# EasyEDA Pro project 测试用途.eprj, board PCB14
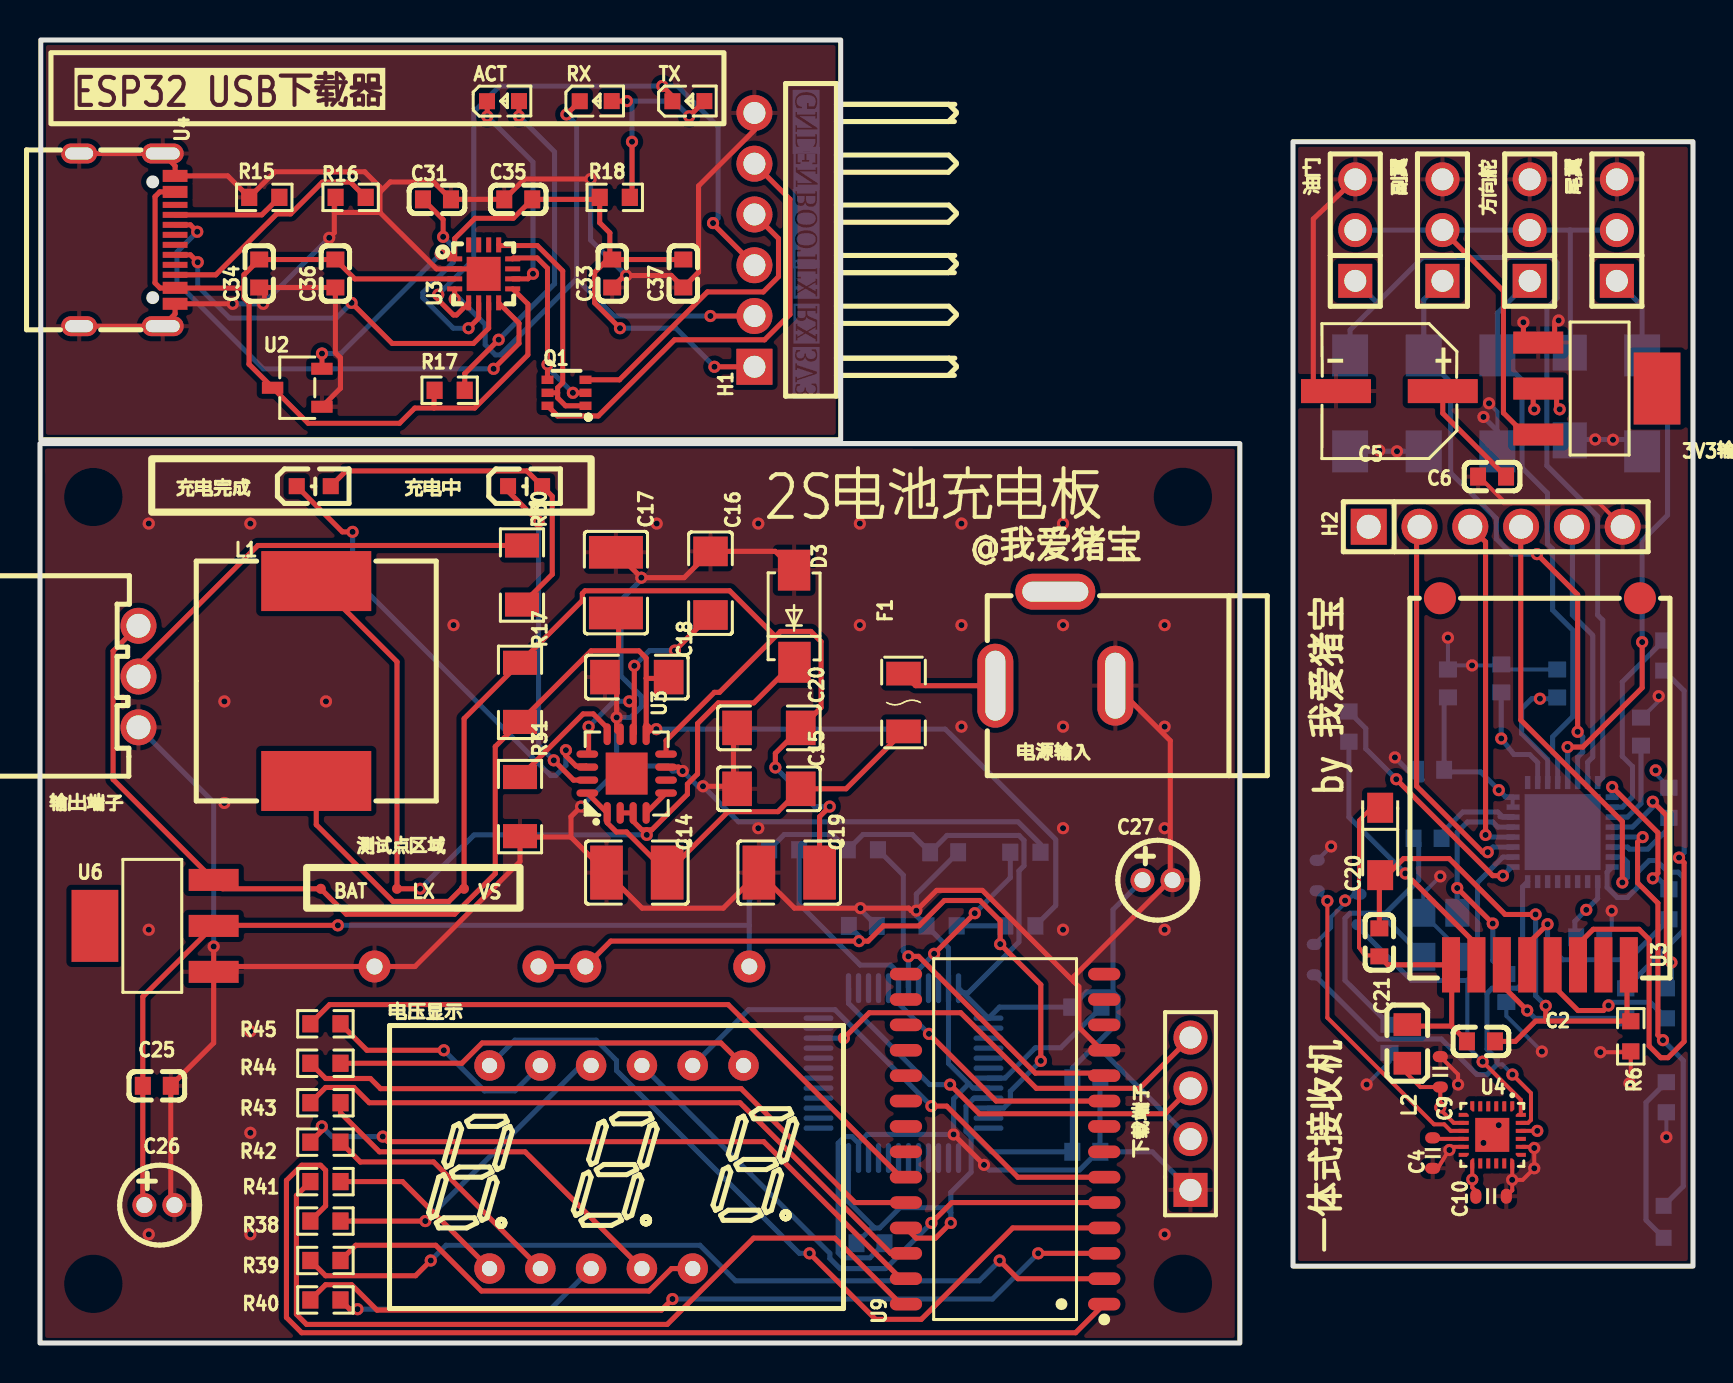
[diagram p13: board, top side]
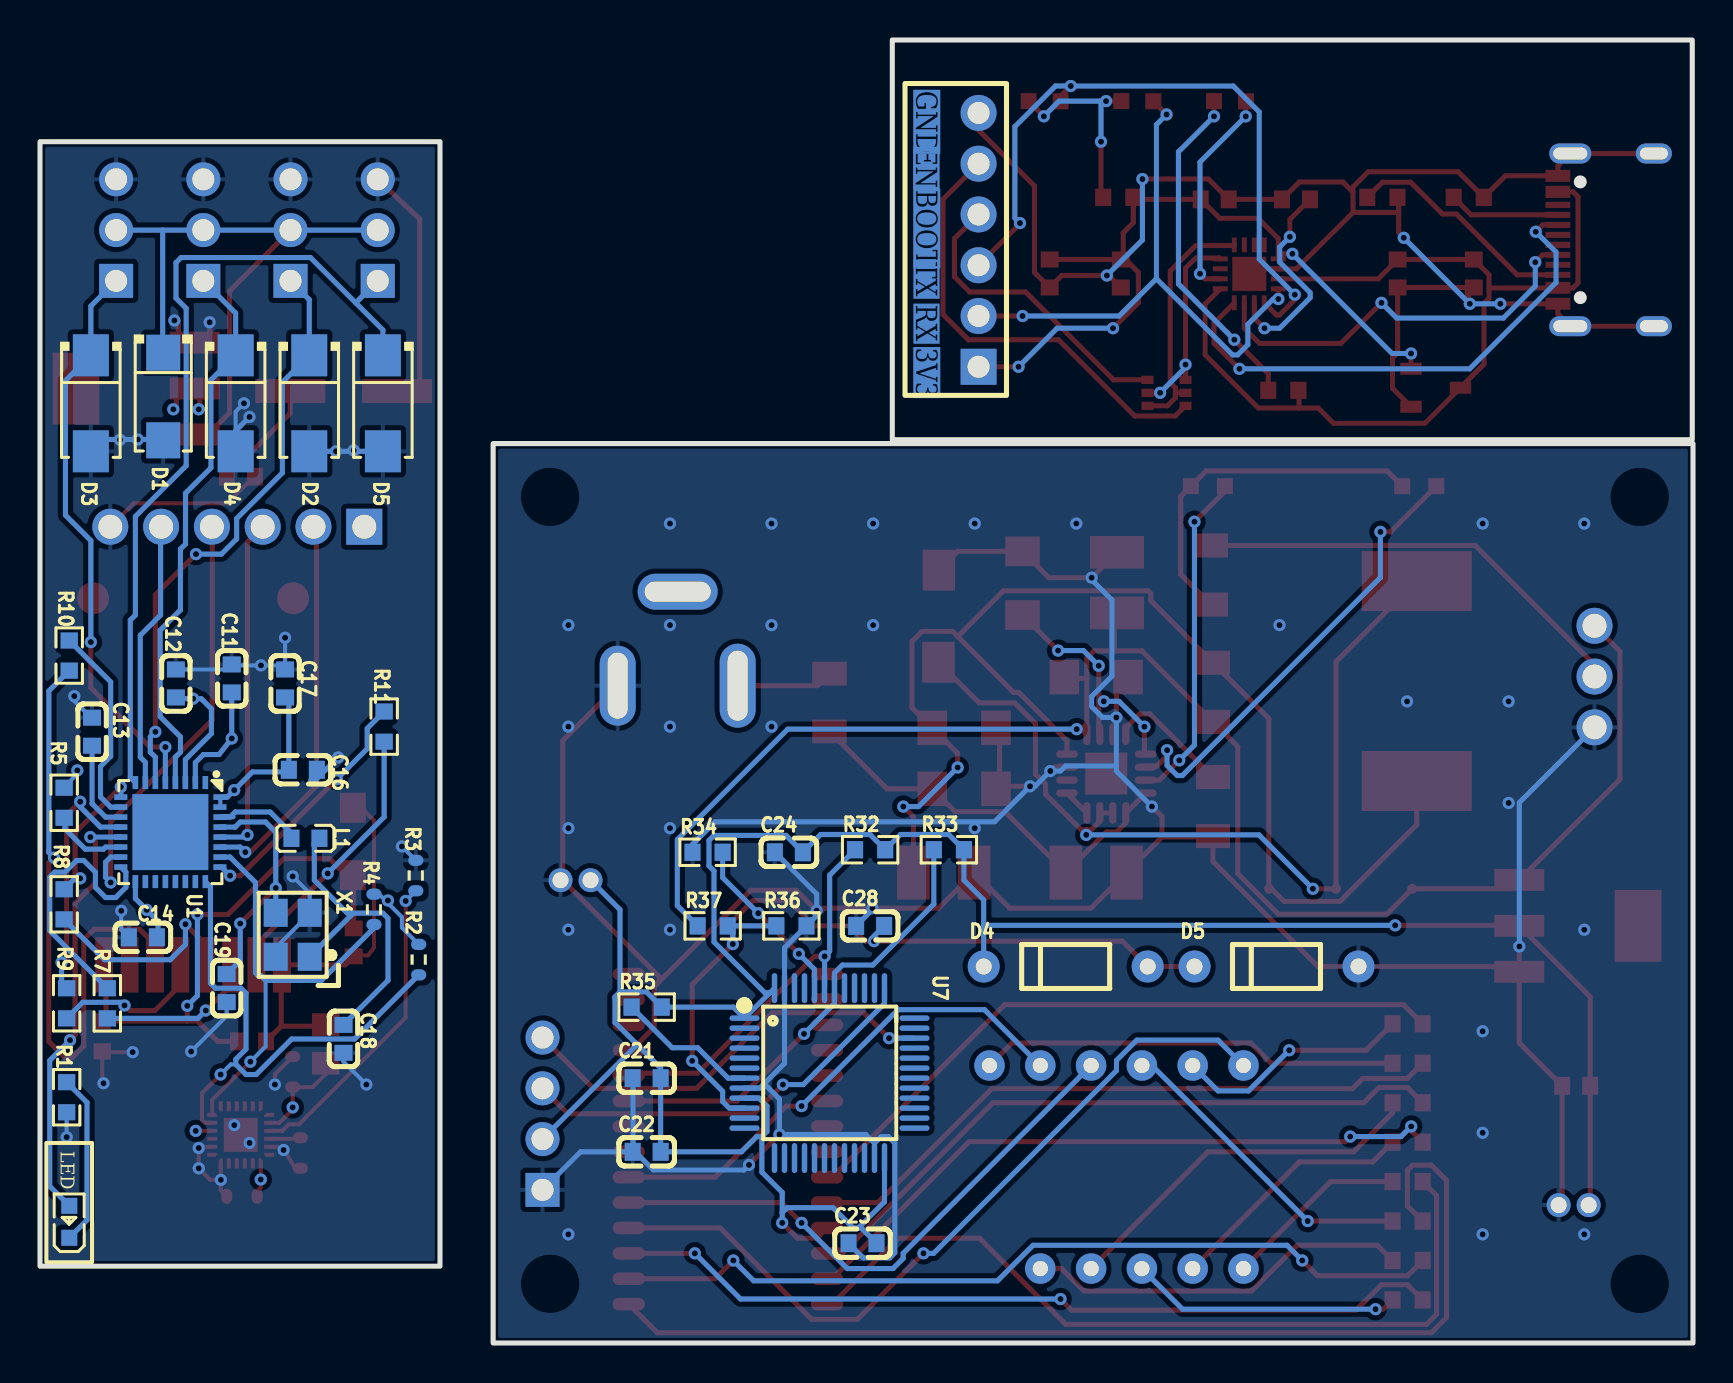
[diagram p14: board, bottom side, seen from below]

Outline 82.66 x 65.19 mm; copper layers: Top Layer, Bottom Layer. Coordinates in mm from the lower left corner of the outline.
Outline path: rectangle 0,45 60,0 ; rectangle 0.04,65.19 40.04,45.19 ; rectangle 62.66,3.84 82.66,60.11
Stack: Top Layer 0.035mm / Dielectric1 1.51mm FR4 er 4.5 / Bottom Layer 0.035mm

## Design rules (mm)
template: JLCPCB Capability(Two Layers Board)
spacing copperThickness1oz (default): track to track 0.102, other pairs 0.152 to 0.3
spacing copperThickness2oz: track to track 0.203, other pairs 0.152 to 0.3
track width copperThickness1oz (default): min 0.127, default 0.254, max 2.54
track width copperThickness2oz: min 0.203, default 0.254, max 2.54
differential pair differentialPair (default): width min 0.127, default 0.254, max 2.54; gap min 0.152, default 0.152
via viaSize (default): diameter min 0.5, default 0.61, max 10; hole min 0.3, default 0.305, max 6.3

## Placement (name value [footprint] x y rotation side)
3V3输出  AMS1117-3.3  [SOT-223-3_L6.5-W3.4-P2.30-LS7.0-BR]  77.89 47.75 180 top
ACT  XL-1608SURC-06  [LED0603-RD_RED]  23.15 62.13 0 top
BAT  -  [Test-Point-0.5mm]  14.04 22.73 180 top
C2  100nF  [C0603]  72.06 15.09 180 top
C4  100nF  [CAP_0603]  69.64 9.5 90 top
C5  100uF  [CAP-SMD_BD6.3-L6.6-W6.6-FD]  67.48 47.63 180 top
C6  100nF  [C0603]  72.61 43.35 0 top
C9  10nF  [CAP_0603]  70.02 13.57 270 top
C10  100nF  [CAP_0603]  72.56 7.34 180 top
C11  100nF  [C0603]  73.07 33.25 270 bottom
C12  10uf  [C0603]  75.87 33 270 bottom
C13  100nF  [C0603]  80.06 30.59 90 bottom
C14  -  [C1210]  29.84 23.54 180 top
C14#2  -  [C0603]  77.52 20.3 180 bottom
C15  100nf  [C1206]  36.45 27.73 0 top
C16  -  [C1206]  33.53 38.02 270 top
C16#2  -  [C0603]  69.52 28.68 0 bottom
C17  -  [C1210]  28.8 38.04 90 top
C17#2  -  [C0603]  70.4 33 270 bottom
C18  -  [C1206]  29.84 33.32 0 top
C18#2  -  [C0603]  67.48 15.22 90 bottom
C19  -  [C1210]  37.47 23.54 180 top
C19#2  -  [C0603]  73.33 17.76 270 bottom
C20  -  [C1206]  36.45 30.78 0 top
C20#2  -  [CAP-SMD_L3.2-W1.6-RD]  67.02 25.1 270 top
C21  -  [C0603]  66.98 20.04 270 top
C21#2  -  [C0603]  52.32 13.25 180 bottom
C22  100nF  [C0603]  52.32 9.57 180 bottom
C23  100nF  [C0603]  41.53 5 180 bottom
C24  100nF  [C0603]  45.21 24.55 180 bottom
C25  100nF  [C0603]  5.84 12.87 180 top
C26  4.7uF  [CAP-TH_BD4.0-P1.50-D0.5-FD]  5.97 6.9 0 top
C27  4.7uF  [CAP-TH_BD4.0-P1.50-D0.5-FD]  55.88 23.16 0 top
C28  100nF  [C0603]  41.15 20.87 180 bottom
C31  100nF  [C0603]  19.85 57.22 180 top
C33  1uF  [C0603]  28.61 53.51 90 top
C34  1uF  [C0603]  10.96 53.51 90 top
C35  1uF  [C0603]  23.91 57.22 0 top
C36  1uF  [C0603]  14.77 53.51 90 top
C37  22uF  [C0603]  32.17 53.51 90 top
D1  SMAJ5.0A  [SMA_L4.4-W2.6-LS5.0-RD]  76.5 47.35 270 bottom
D2  SMAJ3.3A  [SMA_L4.3-W2.7-LS5.1-RD]  69.19 47.01 270 bottom
D3  -  [SMA_L4.3-W2.6-LS5.0-FD]  37.72 36.36 270 top
D3#2  -  [SMA_L4.3-W2.7-LS5.1-RD]  80.12 47.01 270 bottom
D4  -  [SMA_L4.3-W2.7-LS5.1-RD]  72.88 47.01 270 bottom
D4#2  -  [DO-35_BD2.0-L4.2-P8.20-D0.5-RD]  31.37 18.84 180 bottom
D5  -  [SMA_L4.3-W2.7-LS5.1-RD]  65.51 47.01 270 bottom
D5#2  -  [DO-35_BD2.0-L4.2-P8.20-D0.5-RD]  20.83 18.84 180 bottom
F1  SMD1206  [F1206]  43.18 32.05 90 top
H1  PZ254R-11-06P  [HDR-TH_6P-P2.54-H-M-W10.4]  35.73 55.19 90 top
H2  2.54-1x6P直针  [HDR-TH_6P-P2.54-V-M-1]  72.79 40.84 0 top
L1  -  [IND-SMD_L12.0-W12.0_YPRH120X]  13.81 33.12 90 top
L1#2  -  [L0603]  69.39 25.25 0 bottom
L2  GZ2012D601TF  [L0805]  68.37 14.96 270 top
LED  MHT192CRCT  [LED0603-RD]  81.19 6.07 90 bottom
LX  -  [Test-Point-0.5mm]  17.85 22.73 90 top
Q1  UMH3N  [SC-70-6_L2.2-W1.3-P0.65-LS2.1-BR]  26.33 47.54 0 top
R1  200Ω  [R0603]  81.33 12.3 270 bottom
R2  4.7K  [RES_0603]  63.72 19.18 270 bottom
R3  4.7K  [RES_0603]  63.87 23.39 270 bottom
R4  4.7K  [RES_0603]  65.96 21.7 270 bottom
R5  10kΩ  [R0603]  81.45 27.03 270 bottom
R6  0Ω  [R0603]  79.55 15.35 270 top
R7  22Ω  [R0603]  79.29 17 270 bottom
R8  22Ω  [R0603]  81.45 21.95 270 bottom
R9  22Ω  [R0603]  81.33 17 270 bottom
R10  22Ω  [R0603]  81.2 34.4 270 bottom
R11  22Ω  [R0603]  65.45 30.84 270 bottom
R15  5.1kΩ  [R0603]  11.21 57.32 0 top
R16  5.1kΩ  [R0603]  15.53 57.32 0 top
R17  -  [R0603]  20.49 47.67 0 top
R17#2  -  [R1206]  24 32.55 90 top
R18  5.1kΩ  [R0603]  28.74 57.32 0 top
R30  1KΩ  [R1206]  24.1 38.42 270 top
R31  50K  [R1206]  24 26.84 90 top
R32  4.7KΩ  [R0603]  41.15 24.68 180 bottom
R33  4.7KΩ  [R0603]  37.21 24.68 180 bottom
R34  10KΩ  [R0603]  49.28 24.55 180 bottom
R35  10KΩ  [R0603]  52.32 16.81 180 bottom
R36  10KΩ  [R0603]  45.09 20.87 180 bottom
R37  30KΩ  [R0603]  49.02 20.87 180 bottom
R38  200Ω  [R0603]  14.27 6.1 0 top
R39  200Ω  [R0603]  14.27 4.13 0 top
R40  200Ω  [R0603]  14.27 2.16 0 top
R41  200Ω  [R0603]  14.27 8.08 0 top
R42  200Ω  [R0603]  14.27 10.05 0 top
R43  200Ω  [R0603]  14.27 12.02 0 top
R44  200Ω  [R0603]  14.27 14 0 top
R45  200Ω  [R0603]  14.27 15.97 0 top
RX  XL-1608SURC-06  [LED0603-RD_RED]  27.79 62.13 0 top
TX  XL-1608SURC-06  [LED0603-RD_RED]  32.42 62.13 0 top
U1  ESP32-C3FH4  [QFN-32_L5.0-W5.0-P0.50-TL-EP3.7]  76.14 25.56 270 bottom
U2  ME6211A33M3G-N  [SOT-23-3_L2.9-W1.6-P1.90-LS2.8-BR]  12.87 47.79 0 top
U3  -  [WIRELM-SMD_8P-L19.0-W13.0-P1.27-TL]  75 28.09 90 top
U3#2  -  [TQFN-16_L4.0-W4.0-P0.65-BL-EP]  29.34 28.49 0 top
U3#3  -  [TQFN-16_L3.0-W3.0-P0.50-BL-EP1.7]  22.19 53.49 270 top
U4  -  [USB-C-SMD_G-SWITCH_GT-USB-7010ASV]  4.36 55.19 270 top
U4#2  -  [QFN-24_L3.0-W3.0-P0.40-BL-EP]  72.62 10.41 180 top
U6  AMS1117-3.3  [SOT-223-3_L6.5-W3.4-P2.30-LS7.0-BR]  5.72 20.87 0 top
U7  STM32F030C8T6TR  [LQFP-48_L7.0-W7.0-P0.50-LS9.0-BL]  43.18 13.5 270 bottom
U9  CH423S  [SOP-28_L17.9-W7.5-P1.27-LS10.3-BL]  48.26 10.2 90 top
VS  -  [Test-Point-0.5mm]  21.2 22.73 270 top
X1  40MHz  [OSC-SMD_4P-L3.2-W2.5-BL_SIT8008BI]  70.02 20.43 90 bottom
下载端子  PH2.54-01-04PZD  [HDR-TH_4P-P2.54-V-M-1]  57.53 11.47 90 top
充电中  19-217/BHC-ZL1M2RY/3T  [LED0603-R-RD]  24.26 42.87 0 top
充电完成  19-217/BHC-ZL1M2RY/3T  [LED0603-R-RD]  13.69 42.87 0 top
副翼  PZ254V-11-03P  [HDR-TH_3P-P2.54-V-M]  70.13 55.68 90 top
尾翼  PZ254V-11-03P  [HDR-TH_3P-P2.54-V-M]  78.85 55.68 90 top
方向舵  PZ254V-11-03P  [HDR-TH_3P-P2.54-V-M]  74.49 55.68 90 top
油门  PZ254V-11-03P  [HDR-TH_3P-P2.54-V-M]  65.77 55.68 90 top
电压显示  FJ3361BH  [LED-SEG-TH_10P-L22.5-W14.0-P2.54-S10.16-BL]  28.83 8.81 0 top
电源输入  DC-005-5A-2.0  [DC-IN-TH_DC-005-5A-2.0]  50.77 35.24 180 top
输出端子  XH-3AW  [CONN-TH_3P-P2.54_HCTL_XH-3AW]  4.92 33.34 90 top

## Footprints (pads in the part's own frame, mm; a bottom-side part is the same pattern mirrored in y, then rotated)
C0603
  rect 0.8x0.9 smd: 1(-0.7,0) 2(0.7,0)
C1206
  rect 1.485x1.728 smd: 1(-1.593,0) 2(1.593,0)
C1210
  rect 1.635x2.7 smd: 1(-1.518,0) 2(1.518,0)
CAP-SMD_BD6.3-L6.6-W6.6-FD
  rect 3.5x1.2 smd: 1(-2.67,0) 2(2.67,0)
CAP-SMD_L3.2-W1.6-RD
  rect 1.5x1.296 smd: 1(-1.687,0) 2(1.687,0)
CAP-TH_BD4.0-P1.50-D0.5-FD
  round 1.2 hole 0.8: 1(-0.75,0) 2(0.75,0)
CAP_0603
  rrect 0.559x0.762 smd: 1(-0.762,0) 2(0.762,0)
CONN-TH_3P-P2.54_HCTL_XH-3AW
  round 1.8 hole 1.199: 1(-2.54,0) 2(0.002,0) 3(2.54,0)
DC-IN-TH_DC-005-5A-2.0
  oval 1.8x4.2 hole 1x3.5: 1(3,2.352)
  oval 1.8x4 hole 1x3.3: 2(-3,2.352)
  oval 4x1.8 hole 3.3x1: 3(-0.001,-2.352)
DO-35_BD2.0-L4.2-P8.20-D0.5-RD
  round 1.6 hole 0.8: 1(-4.1,0) 2(4.1,0)
F1206
  rect 1.19x1.728 smd: 1(-1.445,0) 2(1.445,0)
HDR-TH_3P-P2.54-V-M
  rect 1.7x1.7 hole 1.1: 1(-2.54,0)
  round 1.7 hole 1.1: 2(0,0) 3(2.54,0)
HDR-TH_4P-P2.54-V-M-1
  rect 1.7x1.7 hole 1.1: 1(-3.81,0)
  round 1.7 hole 1.1: 2(-1.27,0) 3(1.27,0) 4(3.81,0)
HDR-TH_6P-P2.54-H-M-W10.4
  rect 1.8x1.8 hole 1.1: 1(-6.35,0)
  round 1.8 hole 1.1: 2(-3.81,0) 3(-1.27,0) 4(1.27,0) 5(3.81,0) 6(6.35,0)
HDR-TH_6P-P2.54-V-M-1
  rect 1.8x1.8 hole 1.2: 1(-6.35,0)
  round 1.8 hole 1.2: 2(-3.81,0) 3(-1.27,0) 4(1.27,0) 5(3.81,0) 6(6.35,0)
IND-SMD_L12.0-W12.0_YPRH120X
  rect 3x5.5 smd: 1(-5,0) 2(5,0)
L0603
  rect 0.8x0.864 smd: 1(-0.7,0) 2(0.7,0)
L0805
  rect 1.133x1.377 smd: 1(-0.966,0) 2(0.966,0)
LED0603-R-RD
  rect 0.8x0.8 smd: 1(0.851,0) 2(-0.851,0)
LED0603-RD
  rect 0.8x0.8 smd: 1(-0.799,0) 2(0.799,0)
LED0603-RD_RED
  rect 0.8x0.8 smd: 1(-0.799,-0.004) 2(0.799,0.004)
LED-SEG-TH_10P-L22.5-W14.0-P2.54-S10.16-BL
  round 1.524 hole 0.762: 1(-6.35,-5.08) 2(-3.81,-5.08) 3(-1.27,-5.08) 4(1.27,-5.08) 5(3.81,-5.08) 7(6.35,5.08) 8(3.81,5.08) 9(1.27,5.08) 10(-1.27,5.08) 11(-3.81,5.08) 12(-6.35,5.08)
LQFP-48_L7.0-W7.0-P0.50-LS9.0-BL
  oval 0.27x1.5 smd: 1(-2.75,-4.25) 2(-2.25,-4.25) 3(-1.75,-4.25) 4(-1.25,-4.25) 5(-0.75,-4.25) 6(-0.25,-4.25) 7(0.25,-4.25) 8(0.75,-4.25) 9(1.25,-4.25) 10(1.75,-4.25) 11(2.25,-4.25) 12(2.75,-4.25) 25(2.75,4.25) 26(2.25,4.25) 27(1.75,4.25) 28(1.25,4.25) 29(0.75,4.25) 30(0.25,4.25) 31(-0.25,4.25) 32(-0.75,4.25) 33(-1.25,4.25) 34(-1.75,4.25) 35(-2.25,4.25) 36(-2.75,4.25)
  oval 1.5x0.27 smd: 13(4.25,-2.75) 14(4.25,-2.25) 15(4.25,-1.75) 16(4.25,-1.25) 17(4.25,-0.75) 18(4.25,-0.25) 19(4.25,0.25) 20(4.25,0.75) 21(4.25,1.25) 22(4.25,1.75) 23(4.25,2.25) 24(4.25,2.75) 37(-4.25,2.75) 38(-4.25,2.25) 39(-4.25,1.75) 40(-4.25,1.25) 41(-4.25,0.75) 42(-4.25,0.25) 43(-4.25,-0.25) 44(-4.25,-0.75) 45(-4.25,-1.25) 46(-4.25,-1.75) 47(-4.25,-2.25) 48(-4.25,-2.75)
OSC-SMD_4P-L3.2-W2.5-BL_SIT8008BI
  rect 1.4x1.2 smd: 1(-1.1,-0.85) 2(1.1,-0.85) 3(1.1,0.85) 4(-1.1,0.85)
QFN-24_L3.0-W3.0-P0.40-BL-EP
  custom 0.2x0.506 smd: 1(-1,-1.427) 6(1,-1.427) 13(1,1.427) 18(-1,1.427)
  rect 0.2x0.505 smd: 2(-0.6,-1.427) 3(-0.2,-1.427) 4(0.2,-1.427) 5(0.6,-1.427) 14(0.6,1.427) 15(0.2,1.427) 16(-0.2,1.427) 17(-0.6,1.427)
  custom 0.506x0.2 smd: 7(1.427,-1) 12(1.427,1) 19(-1.427,1) 24(-1.427,-1)
  rect 0.505x0.2 smd: 8(1.427,-0.6) 9(1.427,-0.2) 10(1.427,0.2) 11(1.427,0.6) 20(-1.427,0.6) 21(-1.427,0.2) 22(-1.427,-0.2) 23(-1.427,-0.6)
  rect 1.7x1.7 smd: 25(0,0)
QFN-32_L5.0-W5.0-P0.50-TL-EP3.7
  rect 0.65x0.28 smd: 1(-2.478,1.75) 2(-2.478,1.25) 3(-2.478,0.75) 4(-2.478,0.25) 5(-2.478,-0.25) 6(-2.478,-0.75) 7(-2.478,-1.25) 8(-2.478,-1.75) 17(2.478,-1.75) 18(2.478,-1.25) 19(2.478,-0.75) 20(2.478,-0.25) 21(2.478,0.25) 22(2.478,0.75) 23(2.478,1.25) 24(2.478,1.75)
  rect 0.28x0.65 smd: 9(-1.75,-2.478) 10(-1.25,-2.478) 11(-0.75,-2.478) 12(-0.25,-2.478) 13(0.25,-2.478) 14(0.75,-2.478) 15(1.25,-2.478) 16(1.75,-2.478) 25(1.75,2.478) 26(1.25,2.478) 27(0.75,2.478) 28(0.25,2.478) 29(-0.25,2.478) 30(-0.75,2.478) 31(-1.25,2.478) 32(-1.75,2.478)
  rect 3.8x3.8 smd: 33(0,0)
R0603
  rect 0.806x0.864 smd: 1(-0.753,0) 2(0.753,0)
R1206
  rect 1.208x1.701 smd: 1(-1.479,0) 2(1.479,0)
RES_0603
  rrect 0.559x0.762 smd: 1(-0.762,0) 2(0.762,0)
SC-70-6_L2.2-W1.3-P0.65-LS2.1-BR
  rect 0.6x0.42 smd: 1(0.95,-0.65) 2(0.95,0) 3(0.95,0.65) 4(-0.95,0.65) 5(-0.95,0) 6(-0.95,-0.65)
SMA_L4.3-W2.6-LS5.0-FD
  rect 2.046x1.62 smd: 1(-2.304,-0.009) 2(2.304,0.009)
SMA_L4.3-W2.7-LS5.1-RD
  rect 2.1x1.8 smd: 1(-2.4,0) 2(2.4,0)
SMA_L4.4-W2.6-LS5.0-RD
  rect 1.8x1.7 smd: 1(-2.192,0) 2(2.192,0)
SOP-28_L17.9-W7.5-P1.27-LS10.3-BL
  oval 0.63x1.615 smd: 1(-8.255,-4.957) 2(-6.985,-4.957) 3(-5.715,-4.957) 4(-4.445,-4.957) 5(-3.175,-4.957) 6(-1.905,-4.957) 7(-0.635,-4.957) 8(0.635,-4.957) 9(1.905,-4.957) 10(3.175,-4.957) 11(4.445,-4.957) 12(5.715,-4.957) 13(6.985,-4.957) 14(8.255,-4.957) 15(8.255,4.957) 16(6.985,4.957) 17(5.715,4.957) 18(4.445,4.957) 19(3.175,4.957) 20(1.905,4.957) 21(0.635,4.957) 22(-0.635,4.957) 23(-1.905,4.957) 24(-3.175,4.957) 25(-4.445,4.957) 26(-5.715,4.957) 27(-6.985,4.957) 28(-8.255,4.957)
SOT-23-3_L2.9-W1.6-P1.90-LS2.8-BR
  rect 1.07x0.6 smd: 1(1.235,-0.95) 2(1.235,0.95) 3(-1.235,0)
SOT-223-3_L6.5-W3.4-P2.30-LS7.0-BR
  rect 2.5x1.1 smd: 1(2.97,-2.3) 2(2.97,0) 3(2.97,2.3)
  rect 2.34x3.6 smd: 4(-2.97,0)
Test-Point-0.5mm
  round 0.5 smd: 1(0,0)
TQFN-16_L3.0-W3.0-P0.50-BL-EP1.7
  rect 0.25x0.75 smd: 1(-0.749,-1.45) 2(-0.248,-1.45) 3(0.252,-1.45) 4(0.751,-1.45) 9(0.75,1.45) 10(0.25,1.45) 11(-0.25,1.45) 12(-0.749,1.45)
  rect 0.75x0.25 smd: 5(1.45,-0.75) 6(1.45,-0.25) 7(1.45,0.25) 8(1.45,0.75) 13(-1.45,0.75) 14(-1.45,0.25) 15(-1.45,-0.25) 16(-1.45,-0.75)
  rect 1.7x1.7 smd: 17(0.001,0)
TQFN-16_L4.0-W4.0-P0.65-BL-EP
  oval 0.364x1.087 smd: 1(-0.975,-1.968) 2(-0.325,-1.968) 3(0.325,-1.968) 4(0.975,-1.968) 9(0.975,1.968) 10(0.325,1.968) 11(-0.325,1.968) 12(-0.975,1.968)
  oval 1.087x0.364 smd: 5(1.968,-0.975) 6(1.968,-0.325) 7(1.968,0.325) 8(1.968,0.975) 13(-1.968,0.975) 14(-1.968,0.325) 15(-1.968,-0.325) 16(-1.968,-0.975)
  rect 2.1x2.1 smd: 17(0,0)
USB-C-SMD_G-SWITCH_GT-USB-7010ASV
  oval 1x2.1 hole 0.6x1.7: 1(-4.32,1.78) 2(4.32,1.78)
  oval 1x1.8 hole 0.6x1.4: 3(4.32,-2.4) 4(-4.32,-2.4)
  rect 0.6x1.24 smd: A1B12(-3.2,2.4) A4B9(-2.4,2.4) B1A12(3.2,2.4) B4A9(2.4,2.4)
  rect 0.3x1.24 smd: A5(-1.25,2.4) A6(-0.25,2.4) A7(0.25,2.4) A8(1.25,2.4) B5(1.75,2.4) B6(0.75,2.4) B7(-0.75,2.4) B8(-1.75,2.4)
WIRELM-SMD_8P-L19.0-W13.0-P1.27-TL
  rect 2.77x0.9 smd: 1(-9.17,4.445) 2(-9.17,3.175) 3(-9.17,1.905) 4(-9.17,0.635) 5(-9.17,-0.635) 6(-9.17,-1.905) 7(-9.17,-3.175) 8(-9.17,-4.445)
  round 1.6 smd: 9(9.17,-5) 10(9.17,5)

## Nets
3.3V: 3V3输出.2 C9.2 C10.2 C11.2 C12.2 C14#2.2 C16#2.2 C17#2.2 H2.1 L2.2 R2.1 R4.1 R5.1 U1.2 U1.3 U1.17 U1.31 U1.32 U4#2.8 U4#2.13 U4#2.22
3V3: C21#2.2 C22.2 C23.2 C24.2 C25.2 C26.1 C27.1 D4#2.1 R32.2 R33.2 R35.2 U6.2 U7.1 U7.9 U7.24 U7.48 U9.25 下载端子.2
GND: 3V3输出.1 C4.1 C5.2 C6.1 C9.1 C10.1 C11.1 C12.1 C13.2 C14.2 C14#2.1 C15.1 C16.1 C16#2.1 C17.2 C17#2.1 C18.1 C18#2.1 C19.2 C19#2.2 C20.1 C21#2.1 C22.1 C23.1 C24.1 C25.1 C26.2 C27.2 C28.1 C31.1 C33.1 C34.1 C35.1 C36.1 C37.1 D1.2 D2.2 D3.1 D3#2.2 D4.2 D5.2 D5#2.2 H1.6 H2.6 R1.2 R3.1 R6.2 R15.1 R16.1 R31.1 R34.1 R36.2 U1.33 U2.1 U3#2.7 U3#2.11 U3#3.2 U3#3.17 U4.1 U4.2 U4.3 U4.4 U4.A1B12 U4.B1A12 U4#2.11 U4#2.18 U4#2.20 U4#2.25 U6.1 U7.8 U7.23 U7.47 U9.11 X1.2 X1.4 下载端子.1 副翼.3 尾翼.3 方向舵.3 油门.3 电源输入.2 输出端子.1
VBUS: C34.2 C36.2 R17.1 U2.3 U3#3.3 U3#3.9 U4.A4B9 U4.B4A9
VCC: 3V3输出.3 C14.1 C15.2 D1.1 F1.1 U3#2.1 U3#2.16 副翼.2 尾翼.2 方向舵.2 油门.2
VDD_3V3: C33.2 C35.2 C37.2 H1.1 R18.1 U2.2 U3#3.1
ACT#: ACT.1 U3#3.10
AD0: R3.2 U4#2.9
BOOT: H2.4 U1.15
CE: R11.1 U1.25
CHIP_EN: H1.5 H2.5 Q1.6 U1.7
CSN: R7.1 U1.16
D2: D5.1 U1.8 油门.1
D3: D2.1 U1.6 副翼.1
D4: D3#2.1 U1.5 尾翼.1
D5: D4.1 U1.4 方向舵.1
DTR: Q1.2 Q1.4 U3#3.12
GPIO9/BOOT: H1.4 Q1.3
GPIO18/USB_DN: U4.A7
GPIO19/USB_DP: U4.A6
GPIO20/U0RXD: H1.2 H2.2 RX.1 U1.27 U3#3.4
GPIO21/U0TXD: H1.3 H2.3 TX.1 U1.28 U3#3.5
GRID1: U9.4 电压显示.12
GRID2: U9.5 电压显示.9
GRID3: U9.6 电压显示.8
INT: U4#2.12
LED: LED.2 U1.13
MISO: R10.1 U1.10
MOSI: R9.1 U1.12
PA0: C28.2 D4#2.2 D5#2.1 R36.1 R37.2 U7.10
RTS: Q1.1 Q1.5 U3#3.13
S1: R45.1 U9.23
S2: R44.1 U9.24
S3: R43.1 U9.26
S4: R42.1 U9.27
S5: R41.1 U9.28
S6: R38.1 U9.1
S7: R39.1 U9.2
S8: R40.1 U9.3
SCK: R8.1 U1.9
SCL: R2.2 R33.1 U1.24 U4#2.23 U7.42 U9.9
SDA: R4.2 R32.1 U1.26 U4#2.24 U7.43 U9.10
SEG1: R45.2 电压显示.11
SEG2: R44.2 电压显示.7
SEG3: R43.2 电压显示.4
SEG4: R42.2 电压显示.2
SEG5: R41.2 电压显示.1
SEG6: R38.2 电压显示.10
SEG7: R39.2 电压显示.5
SEG8: R40.2 电压显示.3
SWCLK: U7.37 下载端子.3
SWDIO: U7.34 下载端子.4
USB_CC1: R15.2 U4.A5
USB_CC2: R16.2 U4.B5
USB_DN2: U3#3.8 U4.B7
USB_DP2: U3#3.7 U4.B6
V-BAT-1S: R30.1 输出端子.2
V-BAT-2S: BAT.1 C17.1 C18.2 R17#2.1 R37.1 U3#2.9 U6.3 输出端子.3
VOUT: U3#2.4 U3#2.5
$1N454: C31.2 U3#3.6
$1N690: U3#2.15 充电中.2
$1N694: D3.2 L1.2 LX.1 U3#2.2 U3#2.3
$1N699: C16.2 U3#2.10 U3#2.13
$1N702: C19.1 C20.2 L1.1 R17#2.2 U3#2.8 VS.1
$1N706: U3#2.14 充电完成.2
$1N708: R30.2 充电中.1 充电完成.1
$1N712: R31.2 U3#2.12
$1N993: ACT.2 R17.2
$1N997: R18.2 RX.2 TX.2
$1N1088: LED.1 R1.1
$1N1690: F1.2 电源输入.1
$1N3295: C4.2 U4#2.10
$1N4208: C2.1 C20#2.2 C21.1 R6.1 U3.8
$1N4209: C2.2 C20#2.1 C21.2 L2.1 U3.1
$1N5948: C13.1 U1.11
$1N6331: C19#2.1 U1.29 X1.3
$1N6574: C18#2.2 L1#2.1 X1.1
$1N6577: L1#2.2 U1.30
$1N6655: R5.2 U1.14
$1N8224: R7.2 U3.3
$1N8268: R8.2 U3.4
$1N8312: R9.2 U3.5
$1N8356: R10.2 U3.6
$1N8406: R11.2 U3.2
$1N9817: R34.2 U7.44
$1N9875: R35.1 U7.7
$1N9964: C5.1 C6.2

Pads without a net: 3V3输出 4; U1 1 18 19 20 21 22 23; U3 7 9 10; U3#2 6 17; U3#3 11 14 15 16; U4 A8 B8; U4#2 1 2 3 4 5 6 7 14 15 16 17 19 21; U6 4; U7 2 3 4 5 6 11 12 13 14 15 16 17 18 19 20 21 22 25 26 27 28 29 30 31 32 33 35 36 38 39 40 41 45 46; U9 7 8 12 13 14 15 16 17 18 19 20 21 22; 电源输入 3

## Via types
v1: diameter 0.61, hole 0.305, Top Layer to Bottom Layer, 170 vias

## Routing (per net, layer and track width the routed paths; a pad name or vN(x,y) marks a point on that pad's centre or on a via; arc(x,y) is an arc through that point)
3.3V:
  vias: v1(65.26,22.14) v1(70.02,11.79) v1(71.62,8.18) v1(72.95,27.66) v1(73.07,30.25) v1(74.72,46.71) v1(74.87,10.61) v1(75,32.24) v1(75.99,46.71) v1(77.32,21.67) v1(80.79,28.65)
3V3: length 128.4
  Top Layer w0.254: v1(45.55,6.01) 44.78,5.25 43.81,5.25 U9.25 ; v1(14.9,20.9) 8.71,20.9 U6.2 5.14,17.33 C25.2 5.14,6.98 C26.1
  Bottom Layer w0.254: 46.16,17.52 46.41,17.52 48.95,20.06 48.95,23.62 49.21,23.87 49.21,25.14 48.95,25.4 45.36,25.4 C24.2 43.62,25.44 41.16,25.44 R32.2 39.63,25.44 37.22,25.44 R33.2 36.46,23.16 35.47,22.17 35.47,20.9 ; 46.16,17.52 U7.1 47.98,16.81 R35.2 52.33,17.57 53.66,17.57 ; 46.16,17.52 U7.48 ; 35.47,20.9 D4#2.1 ; 35.47,20.9 v1(14.9,20.9) ; 46.56,10.33 46.31,10.58 46.31,11.85 46.71,12.25 U7.9 ; 46.56,10.33 46.56,8.55 45.55,7.54 45.55,6.52 ; 46.56,10.33 46.81,10.33 47.58,9.57 C22.2 C21#2.2 51.62,13.76 52.89,15.03 ; 41.74,5.76 40.43,7.06 U7.24 ; 41.74,5.76 41.59,5.76 C23.2 ; 41.74,5.76 41.99,5.76 43,6.77 45.29,6.77 45.55,6.52 ; 45.55,6.52 v1(45.55,6.01) ; 52.89,15.03 53.91,16.04 53.91,17.31 53.66,17.57 ; 52.89,15.03 52.89,14.84 下载端子.2 ; 53.66,17.57 53.66,21.68 C27.1
GND: length 296.3
  Top Layer w0.25: U3#3.17 21.94,53.74 U3#3.2 19.83,53.74 17,56.57
  Top Layer w0.254: U3#2.7 31.94,28.82 v1(32.14,28.62) ; 8.68,18.57 v1(8.68,19.84) ; 8.68,18.57 8.68,15.01 C25.1 6.54,7.08 C26.2 ; 8.68,18.57 8.95,18.84 18.75,18.84 24,24.09 R31.1 24.05,25.32 26.55,25.32 ; 51.7,18.08 51.95,17.82 51.95,15.79 53.09,14.65 U9.11 ; 51.7,18.08 51.7,18.33 56.52,23.16 ; 51.7,18.08 47.12,22.65 44.84,22.65 v1(43.82,21.63) 43.57,21.63 43.44,21.76 v1(41.03,21.76) 37.73,21.76 C19.2 34.17,21.76 30.11,21.76 26.55,25.32 ; 17,57.58 17,57.84 16.24,58.6 11.74,58.6 R15.1 9.39,58.39 U4.A1B12 6.76,58.89 U4.1 U4.4 ; 17,57.58 17.51,58.09 19.68,58.09 C31.1 C35.1 24.23,58.23 v1(27.53,58.23) ; 17,57.58 17,56.57 14.72,56.57 ; C18.1 28.84,32.73 v1(28.84,31.3) 28.84,30.64 U3#2.11 ; H1.6 35.73,60.68 32.93,57.89 32.93,53.57 C37.1 31.57,53.41 v1(29.31,53.41) 29.21,53.41 C33.1 ; 34.68,27.86 34.68,30.6 C20.1 ; 34.68,27.86 C15.1 ; 34.68,27.86 v1(33.15,27.86) ; 电源输入.2 56.52,30.14 56.52,23.16 ; 14.72,56.57 14.72,57.26 R16.1 ; 14.72,56.57 14.72,55.55 v1(14.46,55.3) ; 56.52,23.16 C27.2 ; 11.21,52.81 11.21,52.05 v1(11.16,51.99) ; 11.21,52.81 C36.1 14.77,49.55 15.02,49.29 15.02,47.77 U2.1 ; 11.21,52.81 C34.1 ; 37.71,38.67 36.77,39.61 C16.1 32.21,38.29 v1(30.07,38.29) C17.2 ; 26.55,25.32 26.55,26.33 v1(27.06,26.84) ; v1(9.64,51.99) U4.B1A12 6.76,51.49 U4.2 U4.3 ; v1(45.68,10.44) v1(47.21,8.91)
  Bottom Layer w0.254: v1(27.06,26.84) 28.84,28.62 28.84,28.87 ; 40.93,10 40.6,10.33 40.24,10.33 39.91,10 39.91,4.52 40.17,4.26 41.5,4.26 C23.1 ; 40.93,10 41.37,10.44 v1(45.68,10.44) 45.68,12.21 46.45,12.98 ; 40.93,10 U7.23 ; 46.45,12.98 45.43,13.99 U7.47 45.43,19.77 R36.2 43.82,21.38 v1(43.82,21.63) 43.82,22.46 C24.1 ; 46.45,12.98 46.67,12.75 U7.8 ; v1(41.03,21.76) 41.03,21.69 C28.1 ; 50.03,24.55 50.03,24.95 48.9,26.08 34.93,26.08 v1(33.15,27.86) 32.9,27.86 v1(32.14,28.62) 31.63,28.62 31.38,28.87 28.84,28.87 ; 53,9.67 53,13.23 C21#2.1 ; 53,9.67 53,9.59 C22.1 55.63,9.57 下载端子.1 ; 53,9.67 51.99,8.66 47.46,8.66 v1(47.21,8.91) ; v1(27.53,58.23) 27.53,55.19 v1(29.31,53.41) ; v1(9.64,51.99) v1(11.16,51.99) v1(14.46,55.3) ; 28.84,28.87 v1(28.84,31.3) 29.53,31.3 30.07,31.84 30.07,32.35 29.05,33.37 29.05,37.18 30.07,38.19 v1(30.07,38.29) ; v1(8.68,19.84) 8.68,27.04 4.92,30.8
  vias: v1(5.44,41) v1(5.44,20.68) v1(5.44,5.44) v1(9.22,32.1) v1(9.22,27.02) v1(10.52,41) v1(10.52,15.6) v1(10.52,10.52) v1(10.52,5.44) v1(14.3,32.1) v1(20.68,35.92) v1(30.84,41) v1(35.92,41) v1(35.92,25.76) v1(41,41) v1(41,35.92) v1(46.08,41) v1(46.08,35.92) v1(46.08,30.84) v1(51.16,41) v1(51.16,35.92) v1(51.16,30.84) v1(51.16,25.76) v1(51.16,20.68) v1(56.24,35.92) v1(56.24,30.84) v1(56.24,25.76) v1(56.24,20.68) v1(56.24,5.44) v1(64.56,24.85) v1(66.34,12.93) v1(66.98,44.66) v1(67.75,29.3) v1(67.86,44.61) v1(70.02,23.35) v1(70.4,35.29) v1(70.48,9.66) v1(70.91,12.93) v1(71.61,33.9) v1(72.18,46.33) v1(72.18,10.01) v1(72.46,47.01) v1(72.94,10.9) v1(73.62,8.16) v1(74.18,51.07) v1(74.72,9.76) v1(74.72,8.74) v1(75.1,14.58) v1(75.94,51.16) v1(77.77,45.21) v1(78.03,14.55) v1(78.6,21.63) v1(78.66,45.19) v1(79.49,13) v1(80.95,32.36) v1(81.33,10.3)
VBUS: length 46.9
  Top Layer w0.25: U3#3.3 15.74,53.24 C36.2 ; R17.1 19.7,47.64 19.7,46.78 ; 19.7,46.78 21.74,46.78 24.4,49.44 24.4,51.98 U3#3.9 ; 19.7,46.78 18.74,46.78 17.98,46.02 13.41,46.02 U2.3
  Top Layer w0.254: 10.2,52.78 10.2,53.45 C34.2 C36.2 ; 10.2,52.78 6.77,52.78 ; 10.2,52.78 10.2,52.27 10.45,52.02 10.45,48.97 U2.3 ; 6.77,52.78 6.01,52.78 5.75,53.04 5.75,57.35 5.99,57.59 U4.A4B9 ; 6.77,52.78 U4.B4A9
VCC: length 52.5
  Top Layer w0.254: 3V3输出.3 74.26,45.45 73.18,46.54 73.18,52.63 副翼.2 ; U3#2.16 U3#2.1 28.36,26.03 28.82,25.57 29.33,25.57 C14.1 34.41,26.59 36.9,26.59 C15.2 40.31,27.73 F1.1
  Bottom Layer w0.254: 76.52,55.68 尾翼.2 ; 76.52,55.68 76.52,49.57 D1.1 ; 76.52,55.68 方向舵.2 副翼.2 油门.2
VDD_3V3: length 37.5
  Top Layer w0.25: U2.2 v1(14.1,49.51) ; C35.2 23.67,56.27 21.75,56.27 20.74,55.26 U3#3.1 20.48,54.49 v1(20.03,54.49)
  Top Layer w0.254: C37.2 C33.2 28.5,54.33 ; 28.5,54.33 27.73,53.57 27.73,52.04 v1(29,50.77) ; 28.5,54.33 28.5,55.54 27.99,56.05 R18.1 27.89,57.22 C35.2 ; v1(33.73,48.84) H1.1
  Bottom Layer w0.25: v1(20.03,54.49) 15.05,49.51 v1(14.1,49.51)
  Bottom Layer w0.254: v1(29,50.77) 31.8,50.77 v1(33.73,48.84)
ACT#: length 10.7
  Top Layer w0.25: v1(24.65,53.5) 24.4,53.24 U3#3.10 ; ACT.1 22.37,61.88 v1(22.37,61.37)
  Bottom Layer w0.25: v1(22.37,61.37) 24.65,59.08 v1(24.65,53.5)
AD0: length 15.7
  Top Layer w0.2: U4#2.9 70.55,10.61 70.22,10.94 69.71,10.94 64.38,16.28 v1(64.38,22.12)
  Bottom Layer w0.2: R3.2 v1(64.38,22.12)
BOOT: length 21.9
  Top Layer w0.254: H2.4 74.05,40.82 74.05,31.17 79.13,26.09 v1(79.13,23.04)
  Bottom Layer w0.254: U1.15 79.13,24.31 79.38,24.06 79.38,23.3 v1(79.13,23.04)
CE: length 12.4
  Top Layer w0.254: v1(73.16,23.38) 72.65,23.38 v1(67.82,28.21)
  Bottom Layer w0.254: v1(73.16,23.38) 73.59,23.81 U1.25 ; v1(67.82,28.21) 66.3,29.73 66.3,30.75 R11.1
CHIP_EN: length 36.1
  Top Layer w0.254: Q1.6 25.89,46.38 27.92,46.38 31.73,50.19 36.23,50.19 37.5,51.46 37.5,57.23 H1.5
  Bottom Layer w0.254: H2.5 76.63,40.82 76.63,36.42 77.64,35.41 77.64,29.31 77.39,29.06 U1.7
CSN: length 13.4
  Bottom Layer w0.254: R7.1 82.17,20.63 82.17,23.3 81.92,23.56 81.41,23.56 80.83,24.14 80.47,24.14 79.89,23.56 79.89,22.8 79.38,22.29 78.87,22.29 78.36,22.8 78.36,23.56 U1.16
D2: length 42.3
  Bottom Layer w0.254: 66.85,52.02 66.85,52.06 油门.1 ; 66.85,52.02 65.51,50.68 D5.1 ; 66.85,52.02 69.14,54.31 75.6,54.31 75.86,54.05 75.86,52.28 75.35,51.77 75.35,43.89 77.89,41.35 77.89,36.42 78.14,36.17 78.14,28.29 U1.8
D3: length 29.6
  Top Layer w0.254: v1(74.86,39.47) 76.89,37.44 v1(76.89,30.58)
  Bottom Layer w0.254: U1.6 76.89,29.31 77.14,29.56 77.14,30.33 v1(76.89,30.58) ; 副翼.1 69.19,52.2 D2.1 70.54,48.07 70.54,43.53 72.83,41.25 72.83,40.23 73.59,39.47 v1(74.86,39.47)
D4: length 28.7
  Top Layer w0.254: v1(76.39,29.82) 77.15,29.82 80.12,32.78 v1(80.12,35.07)
  Bottom Layer w0.254: U1.5 v1(76.39,29.82) ; 尾翼.1 80.12,51.88 D3#2.1 81.39,48.14 81.39,41.42 80.12,40.15 v1(80.12,35.07)
D5: length 27.9
  Bottom Layer w0.254: 方向舵.1 72.88,51.53 D4.1 74.11,48.18 74.11,43.79 75.38,42.52 75.38,39.98 75.64,39.72 75.64,36.68 76.65,35.66 76.65,31.34 75.64,30.33 75.64,29.56 75.89,29.31 U1.4
DTR: length 10.1
  Top Layer w0.25: U3#3.12 23.68,54.29 24.86,54.29 25.38,53.77 v1(25.38,48.95)
  Top Layer w0.254: Q1.4 v1(25.38,48.95) ; v1(26.65,47.54) Q1.2
  Bottom Layer w0.254: v1(26.65,47.54) 25.38,48.81 v1(25.38,48.95)
GPIO9/BOOT: length 15.4
  Top Layer w0.254: Q1.3 28.98,48.19 33.37,52.59 36.17,52.59 36.93,53.35 36.93,55.26 H1.4
GPIO20/U0RXD: length 48.3
  Top Layer w0.25: v1(26.32,61.46) RX.1 ; U3#3.4 v1(20.74,52.23)
  Top Layer w0.254: v1(72.39,24.56) 72.14,24.56 68.84,27.86 68.84,40.69 H2.2 ; v1(33.52,51.38) H1.2
  Bottom Layer w0.25: v1(26.32,61.46) 26.83,60.96 26.83,53.25 23.02,49.44 22.77,49.44 22.26,49.95 22.26,50.96 20.99,52.23 v1(20.74,52.23)
  Bottom Layer w0.254: 26.83,53.25 28.7,51.38 v1(33.52,51.38) ; v1(72.39,24.56) 72.65,24.81 U1.27
GPIO21/U0TXD: length 51.9
  Top Layer w0.25: v1(31.12,62.89) 31.62,62.38 TX.1 ; v1(19.91,52.45) 19.91,52.2 20.68,51.43 20.83,51.43 U3#3.5
  Top Layer w0.254: H1.3 33.66,55.99 v1(33.66,56.03) ; H2.3 72.29,40.08 v1(72.29,25.42)
  Bottom Layer w0.25: v1(19.91,52.45) 21.69,54.23 21.69,61.59 22.99,62.89 v1(31.12,62.89)
  Bottom Layer w0.254: v1(31.12,62.89) 31.88,62.89 33.91,60.86 33.91,56.29 v1(33.66,56.03) ; U1.28 72.39,25.31 v1(72.29,25.42)
GRID1: length 39.2
  Top Layer w0.254: v1(38.48,4.49) 41.78,1.19 44.07,1.19 48.64,5.76 U9.4
  Bottom Layer w0.254: 电压显示.12 23.75,15.16 27.81,15.16 28.83,14.14 28.83,13.63 37.97,4.49 v1(38.48,4.49)
GRID2: length 28.8
  Top Layer w0.254: v1(44.58,6.01) 45.59,7.03 U9.5
  Bottom Layer w0.254: 电压显示.9 39.5,4.49 39.5,4.23 40,3.73 42.29,3.73 v1(44.58,6.01)
GRID3: length 25.2
  Top Layer w0.254: U9.6 48.9,8.3 45.34,11.85 v1(44.58,11.85)
  Bottom Layer w0.254: v1(44.58,11.85) 39.75,16.68 35.43,16.68 电压显示.8
LED: length 21.4
  Top Layer w0.254: v1(80.14,25.31) 79.89,25.06 79.89,23.03 80.9,22.01 80.9,15.41 v1(81.16,15.15)
  Bottom Layer w0.254: LED.2 82.17,7.84 82.17,14.14 v1(81.16,15.15) ; U1.13 v1(80.14,25.31)
MISO: length 10.1
  Bottom Layer w0.254: R10.1 79.13,33.08 79.13,29.35 79.63,28.84 79.63,27.32 79.13,26.81 U1.10
MOSI: length 12.5
  Top Layer w0.254: v1(80.65,27.08) 81.33,26.41 81.33,19.29 v1(81.58,19.04)
  Bottom Layer w0.254: U1.12 79.63,25.81 80.65,26.83 v1(80.65,27.08) ; v1(81.58,19.04) 81.58,18 R9.1
PA0: length 41
  Top Layer w0.254: v1(50.05,14.12) 50.05,17.93 v1(48.01,19.96) 48.01,21.12 47,22.14 45.22,22.14 43.95,20.87 42.17,20.87 41.41,20.11 v1(40.96,20.11) 28.54,20.11 D4#2.2 D5#2.1
  Bottom Layer w0.254: v1(48.01,19.96) 48.01,20.62 R37.2 R36.1 ; U7.10 48.19,11.75 48.52,12.08 48.52,12.59 v1(50.05,14.12) ; v1(40.96,20.11) 40.96,20.36 C28.2
RTS: length 12.3
  Top Layer w0.25: 25.89,47.54 25.89,47.79 26.14,48.05 26.14,53.64 24.87,54.91 22.97,54.91 22.94,54.94
  Top Layer w0.254: Q1.1 26.28,46.89 25.89,47.29 25.89,47.54 Q1.5
S1: length 33.8
  Top Layer w0.254: R45.1 14.48,16.93 34.41,16.93 43.05,8.3 U9.23
S2: length 32.7
  Top Layer w0.254: R44.1 14.28,13.23 16.52,13.23 17.03,12.73 35.06,12.73 40.76,7.03 U9.24
S3: length 33.5
  Top Layer w0.254: R43.1 14.28,12.79 15.7,12.79 16.46,12.02 35,12.02 42.54,4.49 U9.26
S4: length 33.4
  Top Layer w0.254: R42.1 14.09,10.62 v1(14.09,10.84) ; U9.27 43.05,3.22 36.19,10.08 17.39,10.08 v1(17.14,10.33)
  Bottom Layer w0.254: v1(14.09,10.84) 14.6,10.33 v1(17.14,10.33)
S5: length 40.8
  Top Layer w0.254: U9.28 43.05,1.95 39.75,5.25 35.68,5.25 31.36,0.93 13.33,0.93 12.82,1.44 12.82,7.38 R41.1
S6: length 53.9
  Top Layer w0.254: U9.1 51.78,0.51 13.09,0.51 12.32,1.28 12.32,8.13 13.09,8.9 14.03,8.9 14.28,8.64 14.28,6.86 R38.1
S7: length 42.2
  Top Layer w0.254: v1(19.54,4.13) 18.78,3.37 14.28,3.37 R39.1 ; U9.2 48.9,3.22 v1(47.99,4.13)
  Bottom Layer w0.254: v1(47.99,4.13) 46.97,3.11 34.78,3.11 33,4.89 20.3,4.89 v1(19.54,4.13)
S8: length 41.7
  Top Layer w0.254: R40.1 14.28,2.92 15.58,2.92 16.85,1.65 31.07,1.65 v1(31.63,2.2) ; U9.3 v1(49.92,4.49)
  Bottom Layer w0.254: v1(49.92,4.49) 47.63,2.2 v1(31.63,2.2)
SCK: length 7.2
  Top Layer w0.254: v1(80.65,23.25) 80.9,23.5 80.9,25.53 v1(78.62,27.82)
  Bottom Layer w0.254: R8.1 80.91,23.25 v1(80.65,23.25) ; U1.9 v1(78.62,27.82)
SCL: length 49.5
  Top Layer w0.2: v1(73.63,13.43) 74.56,12.5 74.56,11.16 74.41,11.01 U4#2.23
  Top Layer w0.254: v1(44.45,15.47) 47.81,12.11 U9.9
  Bottom Layer w0.2: v1(73.63,13.43) 73.12,13.94 72.87,13.94
  Bottom Layer w0.254: v1(44.45,15.47) 42.93,16.99 U7.42 42.93,18.52 42.54,18.91 41.01,18.91 37.96,21.96 R33.1 ; R2.2 66.93,15.21 70.07,15.21 71.85,13.43 72.36,13.43 72.87,13.94 72.87,14.2 72.36,14.7 72.36,17.5 72.61,17.75 73.88,17.75 74.14,18.01 74.14,22.83 U1.24
SDA: length 41.8
  Top Layer w0.2: U4#2.24 74.05,12.17 v1(72.14,14.08)
  Top Layer w0.254: v1(43.43,19.35) 43.93,19.35 49.78,13.5 53.09,13.5 U9.10
  Bottom Layer w0.2: 71.38,18.14 71.38,14.84 v1(72.14,14.08)
  Bottom Layer w0.254: 41.9,24.68 43.17,23.41 43.17,19.6 v1(43.43,19.35) 43.43,17.76 ; U1.26 73.16,24.31 71.89,23.04 71.89,18.52 71.76,18.39 71.63,18.39 71.38,18.14 68.58,18.14 66.04,20.68 66.04,20.85 R4.2
SEG1: length 11.9
  Top Layer w0.254: R45.2 16.35,14.65 v1(20.19,14.65)
  Bottom Layer w0.254: v1(20.19,14.65) 22.23,12.62 23.75,12.62 电压显示.11
SEG2: length 21
  Top Layer w0.254: R44.2 21.1,14 22.11,15.01 34.05,15.01 电压显示.7
SEG3: length 18.8
  Top Layer w0.254: R43.2 15.03,11.52 16.97,9.57 24.26,9.57 电压显示.4
SEG4: length 12.6
  Top Layer w0.254: 电压显示.2 19.69,9.06 16.02,9.06 R42.2
SEG5: length 9.3
  Top Layer w0.254: 电压显示.1 18.13,8.08 R41.2
SEG6: length 15.8
  Top Layer w0.254: v1(19.27,6.1) R38.2
  Bottom Layer w0.254: v1(19.27,6.1) 27.05,13.89 电压显示.10
SEG7: length 19.3
  Top Layer w0.254: R39.2 15.79,4.89 19.79,4.89 22.08,2.6 30.46,2.6 31.58,3.73 电压显示.5
SEG8: length 13.6
  Top Layer w0.254: R40.2 15.49,1.69 v1(15.88,1.69)
  Bottom Layer w0.254: v1(15.88,1.69) 25.53,1.69 电压显示.3
SWCLK: length 20.7
  Top Layer w0.254: 下载端子.3 56.26,11.47 46.97,11.47 v1(45.51,12.93)
  Bottom Layer w0.254: v1(45.51,12.93) 44.49,12.93 40.43,16.99 U7.37
SWDIO: length 21.7
  Top Layer w0.254: 下载端子.4 54.99,12.74 49.82,12.74 46.04,16.52 41.47,16.52 v1(40.2,15.25)
  Bottom Layer w0.254: U7.34 v1(40.2,15.25)
USB_CC1: length 5.6
  Top Layer w0.254: R15.2 11.09,56.44 U4.A5
USB_CC2: length 11.8
  Top Layer w0.254: U4.B5 8.79,53.44 11.84,56.49 12.53,56.49 14.12,58.08 15.52,58.08 R16.2
USB_DN2: length 26.1
  Top Layer w0.25: U3#3.8 23.95,51.03 23.95,50.01 v1(22.68,48.74) ; U4.B7 7.52,55.94 v1(7.86,55.6)
  Bottom Layer w0.25: v1(22.68,48.74) 11.17,48.74 6.85,53.06 6.85,54.58 v1(7.86,55.6)
USB_DP2: length 20.4
  Top Layer w0.25: v1(7.89,54.07) 7.52,54.44 U4.B6 ; v1(15.58,52.04) 17.61,50.01 21.68,50.01 22.44,50.77 U3#3.7
  Bottom Layer w0.25: v1(7.89,54.07) 7.89,52.88 9.48,51.28 14.82,51.28 v1(15.58,52.04)
V-BAT-1S: length 22.2
  Top Layer w0.254: 输出端子.2 4.92,33.93 10.89,39.9 R30.1
V-BAT-2S: length 81.4
  Top Layer w0.254: 30.31,33.25 30.31,30.97 30.57,30.71 ; 30.31,33.25 30.31,34.27 29.95,34.63 28.93,34.63 ; 30.31,33.25 31.37,33.25 C18.2 ; 输出端子.3 3.65,34.61 3.65,28.2 U6.3 9.13,22.73 BAT.1 15.31,21.46 20.73,21.46 22.77,23.49 22.77,29.84 R17#2.1 27.56,34.63 28.93,34.63 ; 30.57,30.71 U3#2.9 ; 30.57,30.71 v1(30.82,30.71) ; 28.93,34.63 28.93,36.39 C17.1
  Bottom Layer w0.254: v1(30.82,30.71) 45.27,30.71 50.79,25.19 50.79,21.89 49.78,20.87
VOUT: length 1.4
  Top Layer w0.254: U3#2.4 U3#2.5
$1N454: length 10.6
  Top Layer w0.25: C31.2 20.16,56.21 v1(20.16,55.34) ; U3#3.6 21.94,51.28 v1(21.43,50.77)
  Bottom Layer w0.25: v1(20.16,55.34) 20.67,54.84 20.67,54.07 19.14,52.55 19.14,52.3 20.67,50.77 v1(21.43,50.77)
$1N690: length 16.7
  Top Layer w0.254: v1(24.93,41.09) 23.41,42.62 充电中.2 ; U3#2.15 26.68,28.17 v1(25.69,29.15)
  Bottom Layer w0.254: v1(24.93,41.09) 24.93,29.92 v1(25.69,29.15)
$1N694: length 45.5
  Top Layer w0.254: D3.2 35.7,32.03 33.92,32.03 32.88,30.99 32.88,28.47 32.37,27.96 32.37,27.46 30.6,25.68 30.34,25.68 ; 30.34,25.68 v1(30.34,25.42) ; 30.34,25.68 30.09,25.68 29.66,26.1 U3#2.3 U3#2.2 ; v1(19.01,22.73) LX.1 17.85,34.08 L1.2
  Bottom Layer w0.254: v1(19.01,22.73) 21.71,25.42 v1(30.34,25.42)
$1N699: length 12.5
  Top Layer w0.254: 29.72,32.1 29.72,30.51 U3#2.10 ; 29.72,32.1 v1(29.46,32.1) ; 29.72,32.1 v1(29.72,33.88) ; v1(27.43,30.83) 27.43,29.53 U3#2.13 ; C16.2 v1(31.75,34.64)
  Bottom Layer w0.254: v1(27.43,30.83) 28.7,32.1 v1(29.46,32.1) ; v1(31.75,34.64) 30.48,34.64 v1(29.72,33.88)
$1N702: length 64.5
  Top Layer w0.254: L1.1 13.81,25.93 17.65,22.1 20.45,22.1 21.21,22.86 ; 21.21,22.86 21.21,31.24 R17#2.2 27.12,37.15 27.12,37.5 27.25,37.63 34.49,37.63 36.77,35.35 ; 21.21,22.86 21.21,22.73 ; U3#2.8 31.31,30.14 33.72,32.55 33.98,32.55 36.77,35.35 ; C19.1 38.98,26.33 v1(39.49,26.84) ; 36.77,35.35 37.03,35.6 38.55,35.6 39.06,35.09 39.06,31.79 C20.2 36.77,29.51 v1(36.77,28.8)
  Bottom Layer w0.254: v1(39.49,26.84) 38.73,26.84 v1(36.77,28.8)
$1N706: length 23.4
  Top Layer w0.254: U3#2.14 27.31,28.87 26.81,28.87 26.3,29.38 v1(26.3,29.66) ; 充电完成.2 15.12,40.58 v1(15.63,40.58)
  Bottom Layer w0.254: v1(26.3,29.66) 26.3,28.9 25.79,28.39 25.54,28.39 15.63,38.3 v1(15.63,40.58)
$1N708: length 18
  Top Layer w0.254: R30.2 25.62,38.46 25.62,42.36 24.35,43.63 15.3,43.63 充电完成.1
$1N712: length 6.3
  Top Layer w0.254: U3#2.12 28.36,30.78 27.67,31.47 27.16,31.47 R31.2
$1N993: length 17.1
  Top Layer w0.254: R17.2 21.24,48.5 v1(22.94,50.2) ; ACT.2 v1(23.95,61.37)
  Bottom Layer w0.254: v1(22.94,50.2) 25.73,52.99 25.73,59.6 v1(23.95,61.37)
$1N997: length 10.1
  Top Layer w0.254: R18.2 29.6,57.43 v1(29.6,60.1) ; RX.2 v1(29.35,62.14) ; v1(32.46,61.37) TX.2
  Bottom Layer w0.254: 29.6,62.14 31.7,62.14 v1(32.46,61.37) ; 29.6,62.14 v1(29.35,62.14) ; 29.6,62.14 v1(29.6,60.1)
$1N1088: length 8.6
  Bottom Layer w0.254: LED.1 80.31,6.15 80.31,12.04 R1.1
$1N1690: length 4.8
  Top Layer w0.254: 电源输入.1 43.78,32.89 F1.2
$1N4208: length 27.6
  Top Layer w0.254: 67.17,23.22 67.17,23.26 C20#2.2 ; 67.17,23.22 66.98,23.03 C21.1 ; 67.17,23.22 68.18,24.24 70.47,24.24 73.26,21.44 v1(74.79,21.44) ; 75.3,16.11 74.79,16.11 73.77,15.09 C2.1 ; 75.3,16.11 v1(75.3,16.87) ; 75.3,16.11 79.36,16.11 ; 79.36,16.11 79.36,18.83 U3.8 ; 79.36,16.11 R6.1
  Bottom Layer w0.254: v1(75.3,16.87) 74.79,17.38 v1(74.79,21.44)
$1N4209: length 10.2
  Top Layer w0.254: 70.59,15.85 70.59,18.89 U3.1 67.4,18.92 C21.2 ; 70.59,15.85 C2.2 ; 70.59,15.85 68.45,15.85 L2.1
$1N5948: length 4.6
  Bottom Layer w0.254: U1.11 79.38,26.31 80.06,26.99 C13.1
$1N6331: length 12.5
  Top Layer w0.254: v1(70.87,22.76) v1(72.65,20.99)
  Bottom Layer w0.254: v1(72.65,20.99) 72.65,19.14 C19#2.1 ; U1.29 72.9,25.81 72.65,26.07 71.38,26.07 70.87,25.56 v1(70.87,22.76) 70.87,21.53
$1N6574: length 16
  Bottom Layer w0.254: 66.99,21.51 65.51,21.51 65.26,21.25 65.26,18.14 C18#2.2 ; 66.99,21.51 67.29,21.51 68.94,23.16 68.94,25 L1#2.1 ; 66.99,21.51 X1.1
$1N6577: length 4.4
  Bottom Layer w0.254: L1#2.2 70.13,25.3 70.13,25.55 71.15,26.57 72.9,26.57 73.16,26.31 U1.30
$1N6655: length 3.8
  Bottom Layer w0.254: U1.14 79.38,24.81 79.48,24.71 80.4,24.71 81.41,25.73 81.41,26.24 R5.2
$1N8224: length 7.9
  Top Layer w0.254: U3.3 73.1,17.91 v1(74.37,16.64)
  Bottom Layer w0.254: v1(74.37,16.64) 74.76,16.24 R7.2
$1N8268: length 10.7
  Top Layer w0.254: U3.4 74.37,19.94 v1(75.39,20.95)
  Bottom Layer w0.254: v1(75.39,20.95) 75.39,19.94 76.15,19.18 79.43,19.18 R8.2
$1N8312: length 7.7
  Top Layer w0.254: v1(78.43,16.89) 78.18,16.64 76.91,16.64 75.64,17.91 U3.5
  Bottom Layer w0.254: v1(78.43,16.89) 78.59,17.05 80.52,17.05 R9.2
$1N8356: length 31.9
  Top Layer w0.254: v1(81.96,24.28) 82.22,24.03 82.22,15.08 81.41,14.28 81.05,14.28 80.47,14.86 80.47,20.19 79.96,20.7 77.67,20.7 76.91,19.94 U3.6
  Bottom Layer w0.254: v1(81.96,24.28) 82.22,24.54 82.22,32.63 R10.2
$1N8406: length 13.8
  Top Layer w0.254: U3.2 71.83,19.94 v1(68.27,23.49)
  Bottom Layer w0.254: v1(68.27,23.49) 65.45,26.32 R11.2
$1N9817: length 8.7
  Top Layer w0.254: v1(46.74,21.51) v1(44.71,19.47)
  Bottom Layer w0.254: R34.2 48.52,23.28 v1(46.74,21.51) ; v1(44.71,19.47) 43.93,18.69 U7.44
$1N9875: length 7.1
  Bottom Layer w0.254: U7.7 48.25,13.25 49.78,14.77 51.05,14.77 53.08,16.81
$1N9964: length 5.6
  Top Layer w0.254: C6.2 70.15,46.51 C5.1

## Copper pours and planes (outline as drawn; the poured copper is in the pictures)
GND on Top Layer: 67.94,47.31 67.94,-3.77 -6.76,-3.77 -6.76,47.31
GND on Top Layer: -2.37,66.72 43.73,66.72 43.73,43.48 -2.37,43.48
GND on Top Layer: 58.85,0.99 58.85,65.13 87.17,65.13 87.17,0.99
GND on Bottom Layer: 69.34,47.57 69.34,-3.39 -7.01,-3.39 -7.01,47.57
GND on Bottom Layer: 59.23,-1.29 59.23,64.11 88.06,64.11 88.06,-1.29

## Text on the board
Bottom Layer: GND | BOOT | 3V3 | EN | TX | RX
Top Silkscreen Layer: 测试点区域 | ESP32 USB下载器 | @我爱猪宝 | 一体式接收机 | by 我爱猪宝 | 2S电池充电板
